# EAGLE design MainClock (EAGLE 8.7.1)

## Sheet 1 of 2
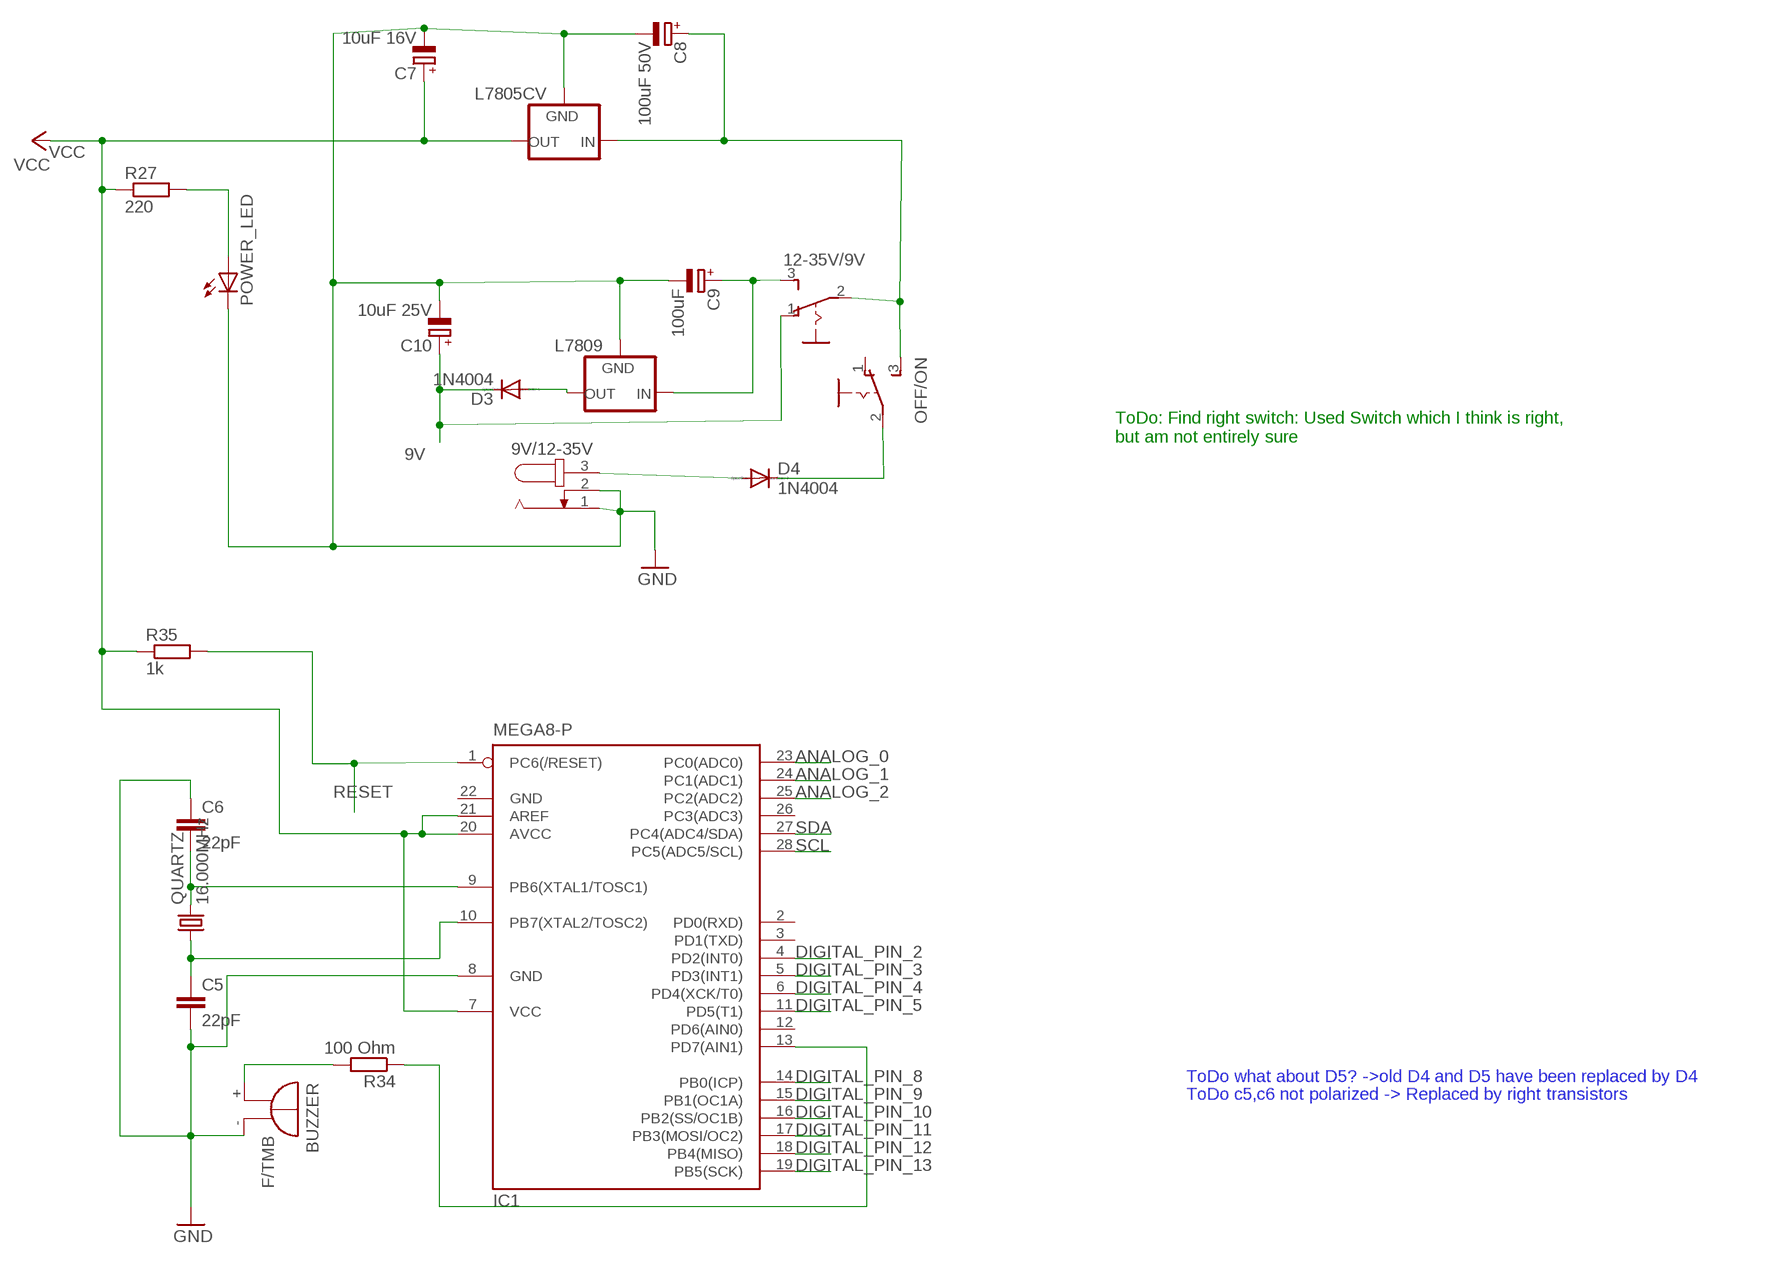
[diagram p0: schematic, sheet 1]

### Parts
9V/12-35V  JACK-PLUG1  [SPC4078]
12-35V/9V  255SB  [255SB]
BUZZER  F/TMB  [F/TMB]
C5  22pF  C-EU025-025X050  [C025-025X050]
C6  22pF  C-EU025-025X050  [C025-025X050]
C7  10uF 16V  CPOL-EUE5-6  [E5-6]
C8  100uF 50V  CPOL-EUE5-8.5  [E5-8,5]
C9  100uF  CPOL-EUE5-8.5  [E5-8,5]
C10  10uF 25V  CPOL-EUE5-6  [E5-6]
D3  1N4004  [DO41-10]
D4  1N4004  [DO41-10]
IC1  MEGA8-P  [DIL28-3]
L7805CV  78XXS  [78XXS]
L7809  78XXS  [78XXS]
OFF/ON  255SB  [255SB]
POWER_LED  LED5MM  [LED5MM]
QUARTZ  16.000MHz  CRYSTALHC49S  [HC49/S]
R27  220  R-EU_0309/10  [0309/10]
R34  100 Ohm  R-EU_0411/15  [0411/15]
R35  1k  R-EU_0309/10  [0309/10]

### Nets
9V: 12-35V/9V.1(O) C10.+ D3.C ; also sheet 2
ANALOG_0: IC1.23(PC0(ADC0)) ; also sheet 2
ANALOG_1: IC1.24(PC1(ADC1)) ; also sheet 2
ANALOG_2: IC1.25(PC2(ADC2)) ; also sheet 2
DIGITAL_PIN_2: IC1.4(PD2(INT0)) ; also sheet 2
DIGITAL_PIN_3: IC1.5(PD3(INT1)) ; also sheet 2
DIGITAL_PIN_4: IC1.6(PD4(XCK/T0)) ; also sheet 2
DIGITAL_PIN_5: IC1.11(PD5(T1)) ; also sheet 2
DIGITAL_PIN_8: IC1.14(PB0(ICP)) ; also sheet 2
DIGITAL_PIN_9: IC1.15(PB1(OC1A)) ; also sheet 2
DIGITAL_PIN_10: IC1.16(PB2(SS/OC1B)) ; also sheet 2
DIGITAL_PIN_11: IC1.17(PB3(MOSI/OC2)) ; also sheet 2
DIGITAL_PIN_12: IC1.18(PB4(MISO)) ; also sheet 2
DIGITAL_PIN_13: IC1.19(PB5(SCK)) ; also sheet 2
GND: 9V/12-35V.1 9V/12-35V.2 BUZZER.- C5.2 C6.1 C7.- C8.- C9.- C10.- IC1.8(GND) L7805CV.GND L7809.GND POWER_LED.K(C) ; also sheet 2
N$1: C6.2 IC1.9(PB6(XTAL1/TOSC1)) QUARTZ.2
N$2: C5.1 IC1.10(PB7(XTAL2/TOSC2)) QUARTZ.1
N$3: BUZZER.+ R34.2
N$4: IC1.13(PD7(AIN1)) R34.1
N$5: 9V/12-35V.3 D4.A
N$6: D4.C OFF/ON.2(P)
N$7: 12-35V/9V.2(P) C8.+ L7805CV.IN OFF/ON.3(S)
N$8: 12-35V/9V.3(S) C9.+ L7809.IN
N$9: POWER_LED.A R27.2
N$10: D3.A L7809.OUT
RESET: IC1.1(PC6(/RESET)) R35.2 ; also sheet 2
SCL: IC1.28(PC5(ADC5/SCL)) ; also sheet 2
SDA: IC1.27(PC4(ADC4/SDA)) ; also sheet 2
VCC: C7.+ IC1.7(VCC) IC1.20(AVCC) IC1.21(AREF) L7805CV.OUT R27.1 R35.1 ; also sheet 2
Unconnected: IC1.2(PD0(RXD)) IC1.3(PD1(TXD)) IC1.12(PD6(AIN0)) IC1.26(PC3(ADC3)) OFF/ON.1(O)

### Notes on the sheet
- ToDo: Find right switch: Used Switch which I think is right,
  but am not entirely sure
- ToDo what about D5? ->old D4 and D5 have been replaced by D4
- ToDo c5,c6 not polarized -> Replaced by right transistors

## Sheet 2 of 2
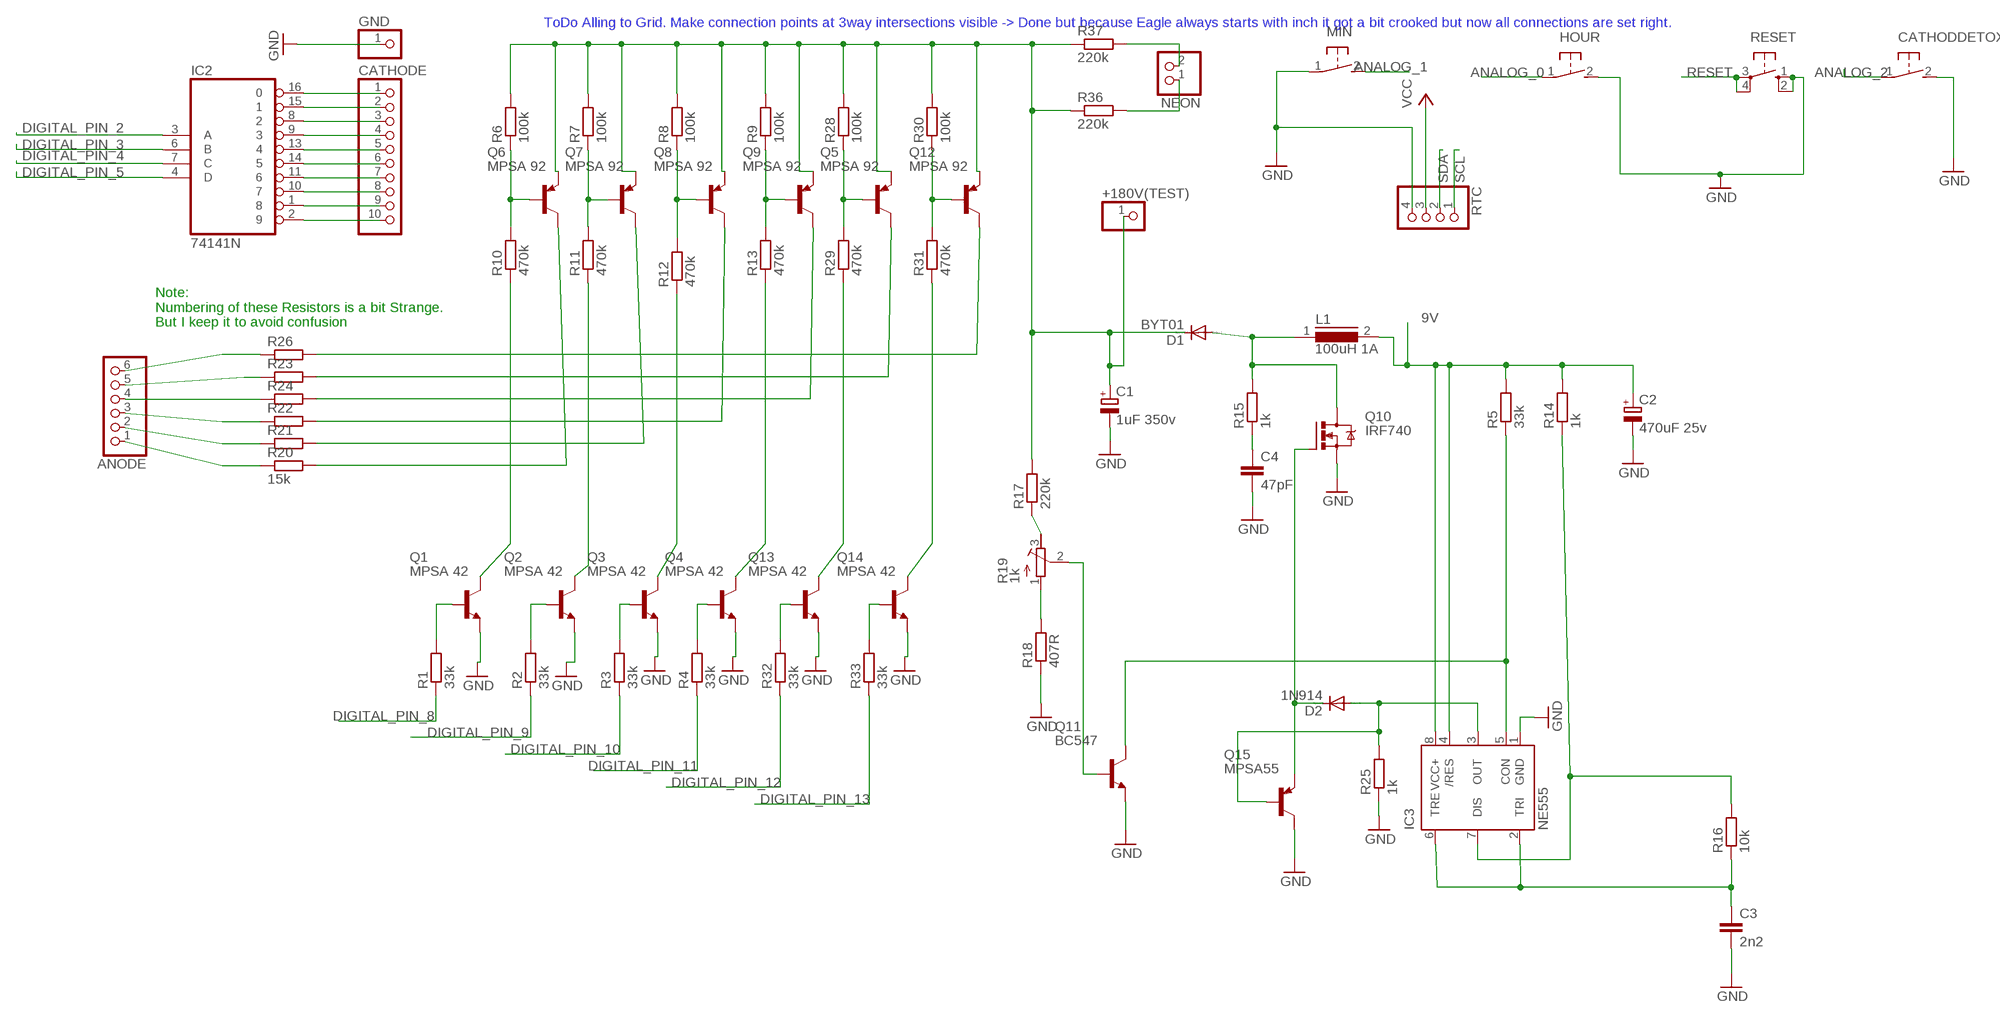
[diagram p1: schematic, sheet 2]

### Parts
+180V(TEST)  PINHD-1X1  [1X01]
ANODE  PINHD-1X6  [1X06]
C1  1uF 350v  CPOL-EUE5-10.5  [E5-10,5]
C2  470uF 25v  CPOL-EUE5-10.5  [E5-10,5]
C3  2n2  C-EU025-024X044  [C025-024X044]
C4  47pF  C-EU025-024X044  [C025-024X044]
CATHODDETOX  31-XX  [B3F-31XX]
CATHODE  PINHD-1X10  [1X10]
D1  BYT01  [F126-10]
D2  1N914  1N4446  [DO35-10]
GND  PINHD-1X1  [1X01]
HOUR  31-XX  [B3F-31XX]
IC2  74141N  [DIL16]
IC3  NE555  [DIL-08]
L1  100uH 1A  MESC26  [MESC26]
MIN  31-XX  [B3F-31XX]
NEON  PINHD-1X2  [1X02]
Q1  MPSA 42  -NPN-TO92  [TO92]
Q2  MPSA 42  -NPN-TO92  [TO92]
Q3  MPSA 42  -NPN-TO92  [TO92]
Q4  MPSA 42  -NPN-TO92  [TO92]
Q5  MPSA 92  MPSA92-PNP-TO92-EBC  [TO92-EBC]
Q6  MPSA 92  MPSA92-PNP-TO92-EBC  [TO92-EBC]
Q7  MPSA 92  MPSA92-PNP-TO92-EBC  [TO92-EBC]
Q8  MPSA 92  MPSA92-PNP-TO92-EBC  [TO92-EBC]
Q9  MPSA 92  MPSA92-PNP-TO92-EBC  [TO92-EBC]
Q10  IRF740  [TO220BV]
Q11  BC547  [TO92]
Q12  MPSA 92  MPSA92-PNP-TO92-EBC  [TO92-EBC]
Q13  MPSA 42  -NPN-TO92  [TO92]
Q14  MPSA 42  -NPN-TO92  [TO92]
Q15  MPSA55  MPSA56-PNP-TO92-BCE  [TO92-BCE]
R1  33k  R-EU_0309/10  [0309/10]
R2  33k  R-EU_0309/10  [0309/10]
R3  33k  R-EU_0309/10  [0309/10]
R4  33k  R-EU_0309/10  [0309/10]
R5  33k  R-EU_0309/10  [0309/10]
R6  100k  R-EU_0309/10  [0309/10]
R7  100k  R-EU_0309/10  [0309/10]
R8  100k  R-EU_0309/10  [0309/10]
R9  100k  R-EU_0309/10  [0309/10]
R10  470k  R-EU_0309/10  [0309/10]
R11  470k  R-EU_0309/10  [0309/10]
R12  470k  R-EU_0309/10  [0309/10]
R13  470k  R-EU_0309/10  [0309/10]
R14  1k  R-EU_0309/10  [0309/10]
R15  1k  R-EU_0309/10  [0309/10]
R16  10k  R-EU_0309/10  [0309/10]
R17  220k  R-EU_0309/10  [0309/10]
R18  407R  R-EU_0309/10  [0309/10]
R19  1k  R-TRIMM3339P  [RTRIM3339P]
R20  15k  R-EU_0309/10  [0309/10]
R21  15k  R-EU_0309/10  [0309/10]
R22  15k  R-EU_0309/10  [0309/10]
R23  15k  R-EU_0309/10  [0309/10]
R24  15k  R-EU_0309/10  [0309/10]
R25  1k  R-EU_0309/10  [0309/10]
R26  15k  R-EU_0309/10  [0309/10]
R28  100k  R-EU_0309/10  [0309/10]
R29  470k  R-EU_0309/10  [0309/10]
R30  100k  R-EU_0309/10  [0309/10]
R31  470k  R-EU_0309/10  [0309/10]
R32  33k  R-EU_0309/10  [0309/10]
R33  33k  R-EU_0309/10  [0309/10]
R36  220k  R-EU_0309/10  [0309/10]
R37  220k  R-EU_0309/10  [0309/10]
RESET  10-XX  [B3F-10XX]
RTC  PINHD-1X4  [1X04]

### Nets
9V: C2.+ IC3.4(/RES) IC3.8(VCC+) L1.2 R5.2 R14.2 ; also sheet 1
ANALOG_0: HOUR.1(P) ; also sheet 1
ANALOG_1: MIN.2(S) ; also sheet 1
ANALOG_2: CATHODDETOX.1(P) ; also sheet 1
DIGITAL_PIN_2: IC2.3(A) ; also sheet 1
DIGITAL_PIN_3: IC2.6(B) ; also sheet 1
DIGITAL_PIN_4: IC2.7(C) ; also sheet 1
DIGITAL_PIN_5: IC2.4(D) ; also sheet 1
DIGITAL_PIN_8: R1.1 ; also sheet 1
DIGITAL_PIN_9: R2.1 ; also sheet 1
DIGITAL_PIN_10: R3.1 ; also sheet 1
DIGITAL_PIN_11: R4.1 ; also sheet 1
DIGITAL_PIN_12: R32.1 ; also sheet 1
DIGITAL_PIN_13: R33.1 ; also sheet 1
GND: C1.- C2.- C3.2 C4.2 CATHODDETOX.2(S) GND.1 HOUR.2(S) IC3.1(GND) MIN.1(P) Q1.1(E) Q2.1(E) Q3.1(E) Q4.1(E) Q10.S Q11.1(E) Q13.1(E) Q14.1(E) Q15.C R18.1 R25.1 RESET.1(S) RESET.2(S1) RTC.4 ; also sheet 1
N$11: ANODE.6 R26.1
N$12: ANODE.5 R23.1
N$13: ANODE.4 R24.1
N$14: ANODE.3 R22.1
N$15: ANODE.2 R21.1
N$16: ANODE.1 R20.1
N$17: Q1.2(B) R1.2
N$18: Q2.2(B) R2.2
N$19: Q13.2(B) R32.2
N$20: Q14.2(B) R33.2
N$21: Q4.2(B) R4.2
N$22: Q3.2(B) R3.2
N$23: Q1.3(C) R10.1
N$24: Q2.3(C) R11.1
N$25: Q3.3(C) R12.1
N$26: Q4.3(C) R13.1
N$27: Q13.3(C) R29.1
N$28: Q14.3(C) R31.1
N$29: Q12.B R30.1 R31.2
N$30: Q5.B R28.1 R29.2
N$31: Q9.B R9.1 R13.2
N$32: Q8.B R8.1 R12.2
N$33: Q7.B R7.1 R11.2
N$34: +180V(TEST).1 C1.+ D1.C Q5.E Q6.E Q7.E Q8.E Q9.E Q12.E R6.2 R7.2 R8.2 R9.2 R17.2 R28.2 R30.2 R36.1 R37.1
N$35: Q12.C R26.2
N$36: Q5.C R23.2
N$37: Q9.C R24.2
N$38: Q8.C R22.2
N$39: Q7.C R21.2
N$40: Q6.C R20.2
N$42: CATHODE.1 IC2.16
N$43: CATHODE.2 IC2.15
N$44: CATHODE.6 IC2.14
N$45: CATHODE.5 IC2.13
N$46: CATHODE.7 IC2.11
N$47: CATHODE.8 IC2.10
N$48: CATHODE.4 IC2.9
N$49: CATHODE.3 IC2.8
N$50: CATHODE.9 IC2.1
N$51: CATHODE.10 IC2.2
N$52: NEON.1 R36.2
N$53: NEON.2 R37.2
N$54: C3.1 IC3.2(TRI) IC3.6(TRE) R16.1
N$55: Q6.B R6.1 R10.2
N$56: D1.A L1.1 Q10.D R15.2
N$57: C4.1 R15.1
N$58: IC3.7(DIS) R14.1 R16.2
N$59: IC3.5(CON) Q11.3(C) R5.1
N$60: R18.2 R19.1(A)
N$61: R17.1 R19.3(E)
N$62: D2.A IC3.3(OUT) Q15.B R25.2
N$63: D2.C Q10.G Q15.E
N$64: Q11.2(B) R19.2(S)
RESET: RESET.3(P) RESET.4(P1) ; also sheet 1
SCL: RTC.1 ; also sheet 1
SDA: RTC.2 ; also sheet 1
VCC: RTC.3 ; also sheet 1

### Notes on the sheet
- ToDo Alling to Grid. Make connection points at 3way intersections visible -> Done but because Eagle always starts with inch it got a bit crooked but now all connections are set right.
- Note:
  Numbering of these Resistors is a bit Strange.
  But I keep it to avoid confusion

## Power pins joined to a net without a drawn wire
GND: IC1.22(GND) IC2.12(GND)
VCC: IC2.5(VCC)

## Library data of the parts
9V/12-35V = con-jack:JACK-PLUG: DC POWER JACK Power Jack, DC, Right Angle, Through Hole, Rated 5A at 16VDC, PC Terminals Distributor: Farnell (www.Farnell.de) Drawing: 84N1161.pdf / 84N1162.pdf Manufacturer: SPC Technology (www.spctechnology.com) Type: SPC4077 / SPC 4078; OC_FARNELL: unknown; OC_NEWARK: unknown
12-35V/9V OFF/ON = switch:255SB: SLIDING SWITCH Distributor Buerklin, 11G810
+180V(TEST) GND = pinhead:PINHD-1X1: PIN HEADER
ANODE = pinhead:PINHD-1X6: PIN HEADER
BUZZER = buzzer:F/TMB: BUZZER Source: Buerklin; OC_FARNELL: unknown; OC_NEWARK: unknown
C1 C2 C7-C10 = resistor:CPOL-EU: POLARIZED CAPACITOR, European symbol
C3-C6 = resistor:C-EU: CAPACITOR, European symbol
CATHODDETOX HOUR MIN = switch-omron:31-XX: OMRON SWITCH; MPN: B3F-3100; OC_FARNELL: 959704; OC_NEWARK: 36M3582
CATHODE = pinhead:PINHD-1X10: PIN HEADER
D1 = diode:BYT01: DIODE ultra fast
D2 = diode:1N4446: DIODE high speed (Philips)
D3 D4 = diode:1N4004: DIODE general purpose rectifier, 1 A
IC1 = atmel:MEGA8-P: MICROCONTROLLER 8 Kbytes FLASH, 1 kbytes SRAM, 512 bytes EEPROM, USART, 4-channel 10 bit ADC, 2-channel 8 bit ADC Pin compatible with Atmega48, ATMega88, ATMega168 Source: avr.lbr; OC_FARNELL: unknown; OC_NEWARK: unknown
IC2 = 74xx-us:74*141: BCD to decimal DECODER/DRIVER
IC3 = st-microelectronics:NE555: General purpose bipolar Timer; MF: Arrow Electronics; MPN: NE555N; OC_FARNELL: 1467742; OC_NEWARK: 89K1486
L1 = inductors:MESC26: INDUCTOR; SPICEPREFIX: L
L7805CV L7809 = v-reg:78XXS: VOLTAGE REGULATOR
NEON = pinhead:PINHD-1X2: PIN HEADER
POWER_LED = led:LED: LED OSRAM: - CHIPLED LG R971, LG N971, LY N971, LG Q971, LY Q971, LO R971, LY R971 LH N974, LH R974 LS Q976, LO Q976, LY Q976 LO Q996 - Hyper CHIPLED LW Q18S LB Q993, LB Q99A, LB R99A - SideLED LS A670, LO A670, LY A670, LG A670, LP A670 LB A673, LV A673, LT A673, LW A673 LH A674 LY A675 LS A676, LA A676, LO A676, LY A676, LW A676 LS A679, LY A679, LG A679 - Hyper Micro SIDELED® LS Y876, LA Y876, LO Y876, LY Y876 LT Y87S - SmartLED LW L88C, LW L88S LB L89C, LB L89S, LG L890 LS L89K, LO L89K, LY L89K LS L896, LA L896, LO L896, LY L896 - TOPLED LS T670, LO T670, LY T670, LG T670, LP T670 LSG T670, LSP T670, LSY T670, LOP T670, LYG T670 LG T671, LOG T671, LSG T671 LB T673, LV T673, LT T673, LW T673 LH T674 LS T676, LA T676, LO T676, LY T676, LB T676, LH T676, LSB T676, LW T676 LB T67C, LV T67C, LT T67C, LS T67K, LO T67K, LY T67K, LW E67C LS E67B, LA E67B, LO E67B, LY E67B, LB E67C, LV E67C, LT E67C LW T67C LS T679, LY T679, LG T679 LS T770, LO T770, LY T770, LG T770, LP T770 LB T773, LV T773, LT T773, LW T773 LH T774 LS E675, LA E675, LY E675, LS T675 LS T776, LA T776, LO T776, LY T776, LB T776 LHGB T686 LT T68C, LB T68C - Hyper Mini TOPLED® LB M676 - Mini TOPLED Santana® LG M470 LS M47K, LO M47K, LY M47K Source: http://www.osram.convergy.de LUXEON: - LUMILED® LXK2-PW12-R00, LXK2-PW12-S00, LXK2-PW14-U00, LXK2-PW14-V00 LXK2-PM12-R00, LXK2-PM12-S00, LXK2-PM14-U00 LXK2-PE12-Q00, LXK2-PE12-R00, LXK2-PE12-S00, LXK2-PE14-T00, LXK2-PE14-U00 LXK2-PB12-K00, LXK2-PB12-L00, LXK2-PB12-M00, LXK2-PB14-N00, LXK2-PB14-P00, LXK2-PB14-Q00 LXK2-PR12-L00, LXK2-PR12-M00, LXK2-PR14-Q00, LXK2-PR14-R00 LXK2-PD12-Q00, LXK2-PD12-R00, LXK2-PD12-S00 LXK2-PH12-R00, LXK2-PH12-S00 LXK2-PL12-P00, LXK2-PL12-Q00, LXK2-PL12-R00 Source: www.luxeon.com KINGBRIGHT: KA-3528ASYC Source: www.kingbright.com
Q1-Q4 Q13 Q14 = transistor:*-NPN-: NPN Transistror BF959 corrected 2008.03.06
Q5-Q9 Q12 Q15 = transistor:*-PNP-: PNP Transistror
Q10 = transistor-power:IRF740: N-CHANNEL MOS FET
Q11 = transistor:BC547: NPN TRANSISTOR
QUARTZ = crystal:CRYSTAL: CRYSTAL; OC_FARNELL: 1667008; OC_NEWARK: unknown
R1-R18 R20-R37 = resistor:R-EU_: RESISTOR, European symbol
R19 = resistor:R-TRIMM: Trimm resistor
RESET = switch-omron:10-XX: OMRON SWITCH; MPN: B3F-1000; OC_FARNELL: 176432; OC_NEWARK: 36M3542
RTC = pinhead:PINHD-1X4: PIN HEADER

## Board
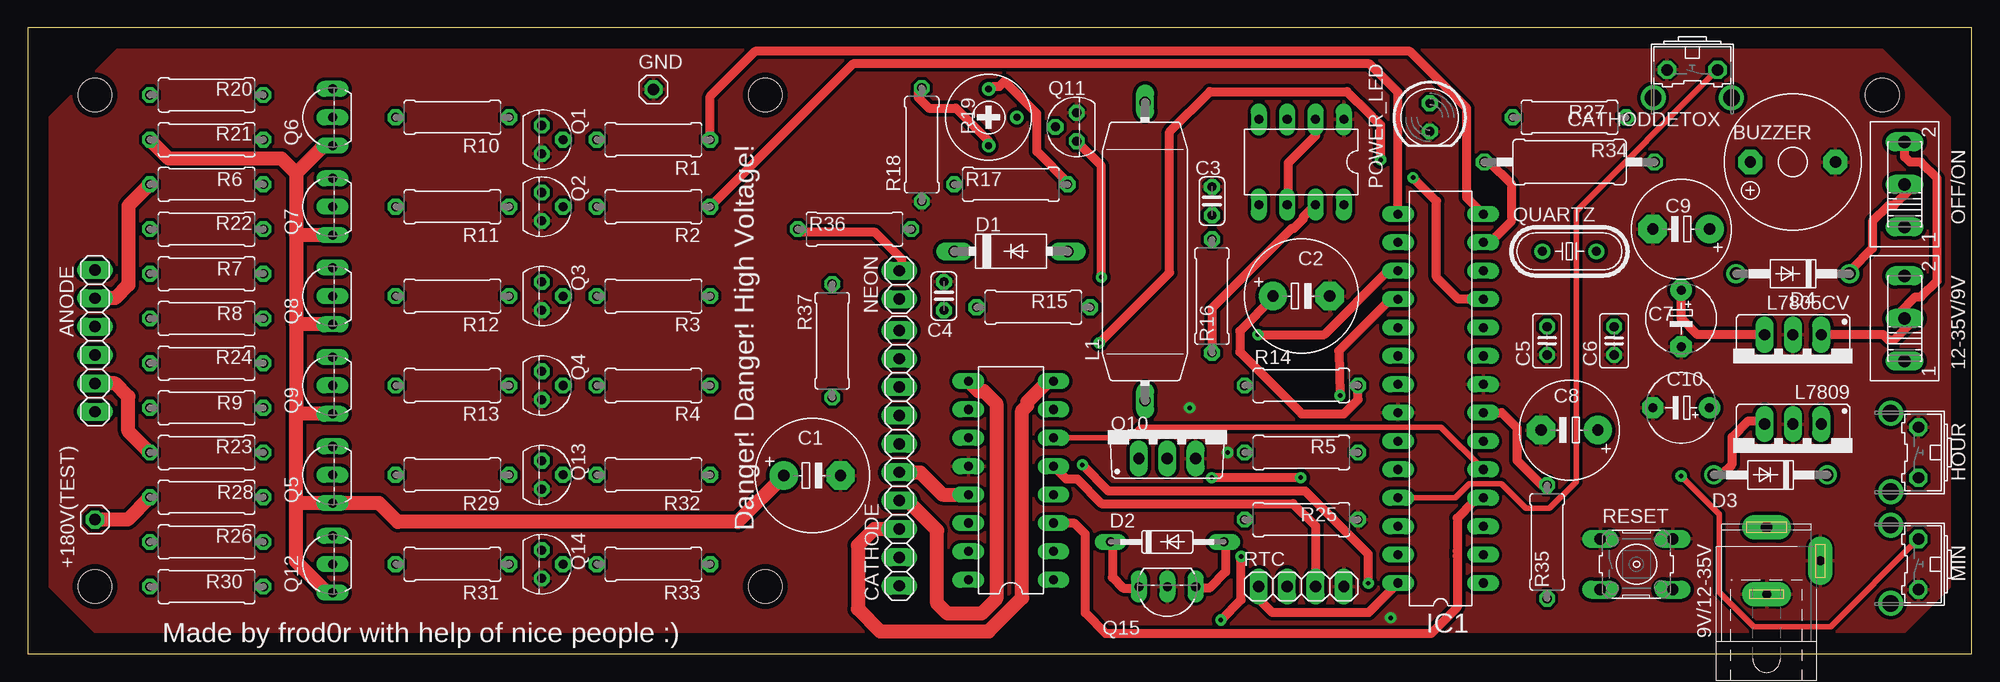
[diagram p2: board, top side]
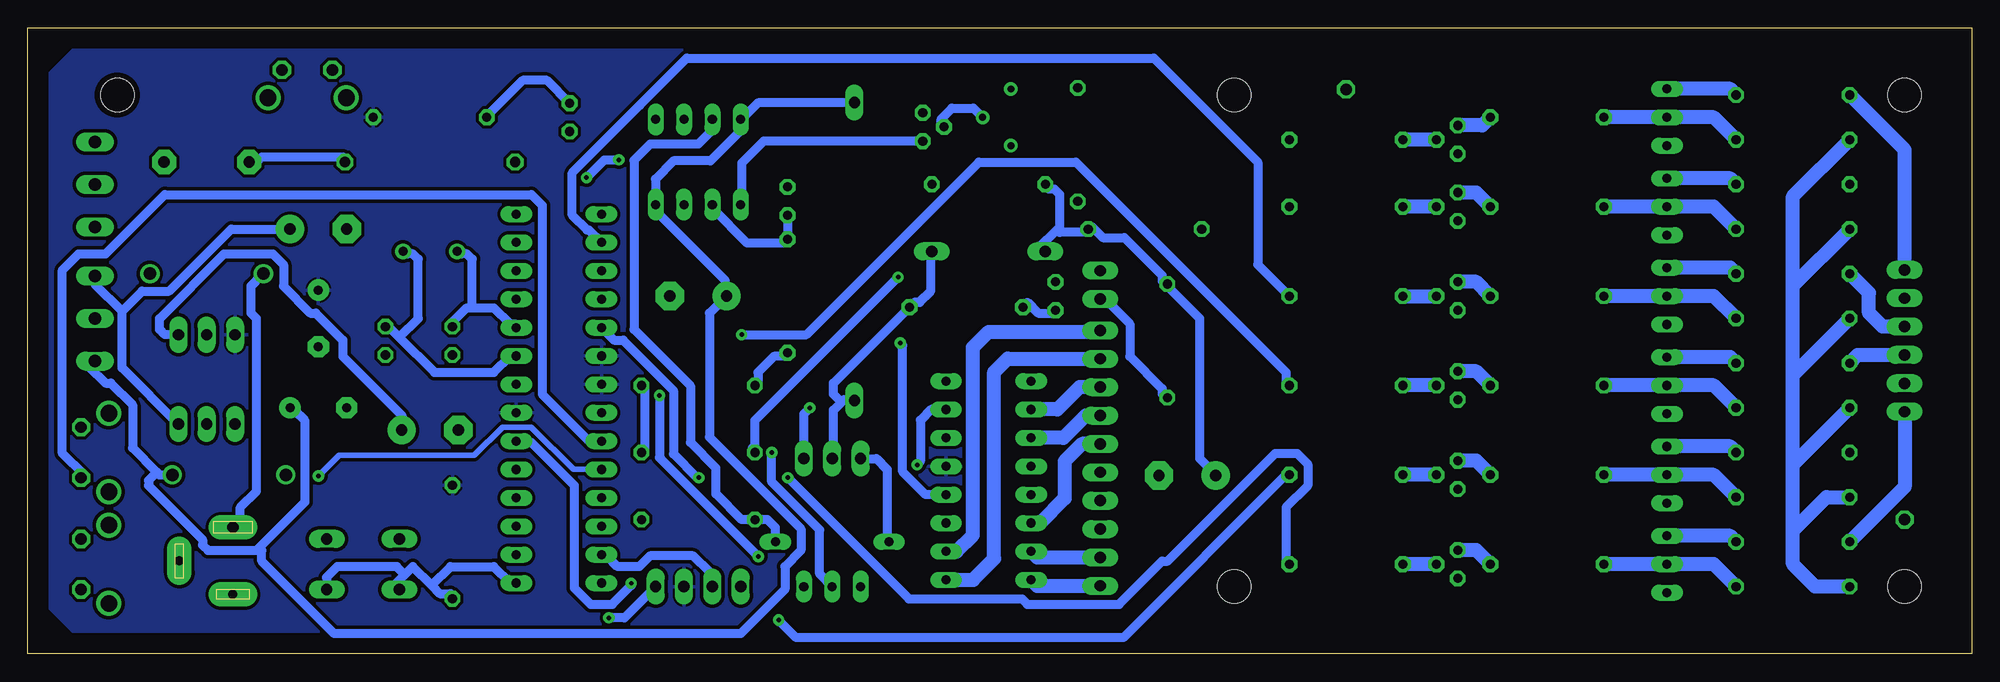
[diagram p3: board, bottom side, seen from below]

Size 174 x 56 mm. Coordinates in mm from the lower left corner, seen from the top.
Outline: 0,0 174,0 174,56 0,56 0,0
Copper layers (1*16): Top 0.035mm / dielectric 1.5mm / Bottom 0.035mm
Design rules "FVM_default": minimum track width 0.3mm, minimum drill 0.4mm, track to track 0.3mm, track to pad 0.3mm, pad to pad 0.3mm, via to via 0.3mm, smd to smd 0.15mm, copper to edge 0.5mm, drill to drill 0.2mm, minimum pad ring 0.3mm, minimum via ring 0.3mm, stop-mask expansion 0.075mm, vias tented up to drill 0mil, thermal gap 0.2mm
Holes 3 mm at 166,50 6,50 66,50 66,6 6,6

### Footprints (pad centres in the part's own frame; a part is rotated, then mirrored left to right if it is on the bottom)
SPC4078 = drill 0.8 pad 2.184 long: 1 -3,0; 2 0,-4.8 | drill 1 pad 2.184 long: 3 3,0
255SB = drill 1.118 long: 1 -3.81,0; 2 0,0; 3 3.81,0
1X01 = drill 1.016 octagon: 1 0,0
1X06 = drill 1.016 long: 1 -6.35,0; 2 -3.81,0; 3 -1.27,0; 4 1.27,0; 5 3.81,0; 6 6.35,0
F/TMB = drill 1.016 pad 2.159 octagon: + 3.81,0; - -3.81,0
E5-10,5 = drill 1.016 pad 2.54: + -2.54,0 | drill 1.016 pad 2.54 octagon: - 2.54,0
C025-024X044 = drill 0.813 octagon: 1 -1.27,0; 2 1.27,0
C025-025X050 = drill 0.813 octagon: 1 -1.27,0; 2 1.27,0
E5-6 = drill 0.813 pad 1.905: + -2.54,0 | drill 0.813 pad 1.905 octagon: - 2.54,0
E5-8,5 = drill 1.016 pad 2.54: + -2.54,0 | drill 1.016 pad 2.54 octagon: - 2.54,0
B3F-31XX = drill 1.016 octagon: 1 -2.261,-1.245; 2 2.261,-1.245 | drill 1.499 pad 2.159: 3 -3.505,1.245; 4 3.505,1.245
1X10 = drill 1.016 long: 1 -11.43,0; 2 -8.89,0; 3 -6.35,0; 4 -3.81,0; 5 -1.27,0; 6 1.27,0; 7 3.81,0; 8 6.35,0; 9 8.89,0; 10 11.43,0
F126-10 = drill 1.016 long: A 5.08,0; C -5.08,0
DO35-10 = drill 0.813 long: A 5.08,0; C -5.08,0
DO41-10 = drill 1.118: A 5.08,0; C -5.08,0
DIL28-3 = drill 0.813 long: 1 -16.51,-3.81; 2 -13.97,-3.81; 3 -11.43,-3.81; 4 -8.89,-3.81; 5 -6.35,-3.81; 6 -3.81,-3.81; 7 -1.27,-3.81; 8 1.27,-3.81; 9 3.81,-3.81; 10 6.35,-3.81; 11 8.89,-3.81; 12 11.43,-3.81; 13 13.97,-3.81; 14 16.51,-3.81; 15 16.51,3.81; 16 13.97,3.81; 17 11.43,3.81; 18 8.89,3.81; 19 6.35,3.81; 20 3.81,3.81; 21 1.27,3.81; 22 -1.27,3.81; 23 -3.81,3.81; 24 -6.35,3.81; 25 -8.89,3.81; 26 -11.43,3.81; 27 -13.97,3.81; 28 -16.51,3.81
DIL16 = drill 0.813 long: 1 -8.89,-3.81; 2 -6.35,-3.81; 3 -3.81,-3.81; 4 -1.27,-3.81; 5 1.27,-3.81; 6 3.81,-3.81; 7 6.35,-3.81; 8 8.89,-3.81; 9 8.89,3.81; 10 6.35,3.81; 11 3.81,3.81; 12 1.27,3.81; 13 -1.27,3.81; 14 -3.81,3.81; 15 -6.35,3.81; 16 -8.89,3.81
DIL-08 = drill 0.813 long: 1 -3.81,-3.81; 2 -1.27,-3.81; 3 1.27,-3.81; 4 3.81,-3.81; 5 3.81,3.81; 6 1.27,3.81; 7 -1.27,3.81; 8 -3.81,3.81
MESC26 = drill 1.016 long: 1 -13.335,0; 2 13.335,0
78XXS = drill 1.016 long: GND 0,-2.54; IN -2.54,-2.54; OUT 2.54,-2.54
1X02 = drill 1.016 long: 1 -1.27,0; 2 1.27,0
LED5MM = drill 0.813 octagon: A -1.27,0; K 1.27,0
TO92 = drill 0.813 octagon: 1 1.27,0; 2 0,1.905; 3 -1.27,0
TO92-EBC = drill 0.813 long: B 0,-1.27; C 2.54,-1.27; E -2.54,-1.27
TO220BV = drill 1.016 long: D 0,-2.54; G -2.54,-2.54; S 2.54,-2.54
TO92-BCE = drill 0.813 long: B -2.54,0; C 0,0; E 2.54,0
HC49/S = drill 0.813: 1 -2.413,0; 2 2.413,0
0309/10 = drill 0.813 octagon: 1 -5.08,0; 2 5.08,0
RTRIM3339P = drill 0.61: 1 -2.54,0; 2 0,-2.54; 3 2.54,0
0411/15 = drill 0.914 octagon: 1 -7.62,0; 2 7.62,0
B3F-10XX = drill 1.016 long: 1 -3.251,2.261; 2 3.251,2.261; 3 -3.251,-2.261; 4 3.251,-2.261
1X04 = drill 1.016 long: 1 -3.81,0; 2 -1.27,0; 3 1.27,0; 4 3.81,0

### Placement (x,y rotation side)
9V/12-35V  155.65,8.31 90 top
12-35V/9V  168,30 90 top
+180V(TEST)  6,12 0 top
ANODE  6,28 270 top
BUZZER  158,44 180 top
C1  70.21,15.94 0 top
C2  114,32 0 top
C3  106,40.5 90 top
C4  82,32 90 top
C5  136,28 270 top
C6  142,28 90 top
C7  148,30 270 top
C8  138,20 180 top
C9  148,38 180 top
C10  148,22 180 top
CATHODDETOX  149,51 180 top
CATHODE  78,17.5 90 top
D1  88,36 0 top
D2  102,10 0 top
D3  156,16 180 top
D4  158,34 180 top
GND  56,50.5 0 top
HOUR  168,18 90 top
IC1  126.47,22.83 90 top
IC2  88,15.5 90 top
IC3  114,44 180 top
L1  100,36 90 top
L7805CV  158,26 180 top
L7809  158,18 180 top
MIN  168,8 90 top
NEON  78,33 270 top
OFF/ON  168,42 90 top
POWER_LED  125.5,48 270 top
Q1  46,46 270 top
Q2  46,40 270 top
Q3  46,32 270 top
Q4  46,24 270 top
Q5  26,16 90 top
Q6  26,48 90 top
Q7  26,40 90 top
Q8  26,32 90 top
Q9  26,24 90 top
Q10  102,20 0 top
Q11  93.89,47.14 90 top
Q12  26,8 90 top
Q13  46,16 270 top
Q14  46,8 270 top
Q15  102,6 180 top
QUARTZ  138,36 0 top
R1  56,46 180 top
R2  56,40 180 top
R3  56,32 180 top
R4  56,24 180 top
R5  114,18 0 top
R6  16,46 180 top
R7  16,38 180 top
R8  16,30 180 top
R9  16,22 180 top
R10  38,48 180 top
R11  38,40 180 top
R12  38,32 180 top
R13  38,24 180 top
R14  114,24 0 top
R15  90,31 0 top
R16  106,32 270 top
R17  88,42 180 top
R18  80.02,45.55 90 top
R19  86,48 90 top
R20  16,50 0 top
R21  16,42 0 top
R22  16,34 0 top
R23  16,18 0 top
R24  16,26 0 top
R25  114,12 180 top
R26  16,10 0 top
R27  138,48 180 top
R28  16,14 180 top
R29  38,16 180 top
R30  16,6 180 top
R31  38,8 180 top
R32  56,16 180 top
R33  56,8 180 top
R34  138,44 0 top
R35  136,10 270 top
R36  74,38 180 top
R37  72,28 270 top
RESET  144,8 0 top
RTC  114,6 0 top

### Tracks (layer width: path | path; a pad name or v marks a point on that pad's centre or on a via)
9V
  Top 0.813: C2.+ 111.55,31.92 108.5,28.87 108.5,27 114.05,21.45 117.8,21.45 119.08,22.73 R14.2
  Bottom 0.813: 162.46,16.24 164.64,18.41 164.64,22.27 166.57,24.2 167.05,24.2 168.5,25.65 168.5,26.13 168.01,26.61 12-35V/9V.1 | 162.46,16.24 162.22,15.99 161.26,15.99 D3.C | 153.29,9.48 153.54,9.24 157.88,9.24 158.36,9.72 158.36,10.2 163.19,15.03 163.19,15.51 162.46,16.24 | 153.29,9.48 149.19,13.58 149.19,20.82 150.16,21.79 C10.+ | L1.2 100.45,49.3 108.66,49.3 110.1,47.85 IC3.4 110.19,46.81 112.9,44.1 116.2,44.1 117.82,42.48 117.82,41.09 117.82,40.61 IC3.8 117.82,40.12 117.82,39.64 111.55,33.37 111.55,32.4 C2.+ 111.55,31.92 113,30.47 113,19.37 104.79,11.17 104.79,9.24 106.24,7.79 106.24,5.76 110.2,1.8 146.58,1.8 153.05,8.27 153.05,9.24 153.29,9.48 | R5.2 118.79,18.41 118.79,23.72 R14.2
ANALOG_0
  Bottom 0.813: IC1.23 123.13,18.89 123.61,18.89 127.96,23.23 127.96,40.12 128.92,41.09 161.74,41.09 167.05,35.78 169.46,35.78 170.91,34.33 170.91,17.93 168.98,15.99 HOUR.1
ANALOG_1  (via drill 0.4)
  Top 0.508: MIN.2 161.38,2.4 154.5,2.4 151.4,5.5 151.4,12.49 v147.99,15.9
  Bottom 0.508: IC1.24 125.16,16.48 128.96,20.28 131.51,20.28 134.05,17.74 146.15,17.74 v147.99,15.9
ANALOG_2
  Top 0.508: CATHODDETOX.1 138.6,39.58 138.6,15.4 136.2,13 134.1,13 131.9,15.2 129.05,15.2 127.79,13.94 IC1.25
DIGITAL_PIN_2
  Top 0.813: IC2.3 92.25,11.65 93.69,11.65 94.66,10.69 94.66,3.64 96.5,1.8 102.6,1.8 125.6,1.8 127.96,4.16 127.96,8.76 127.96,9.2 127.96,12.13 129.41,13.58 129.41,14.06 129.89,14.06 IC1.4
DIGITAL_PIN_3
  Top 0.508: IC2.6 98.58,19.31 99.55,20.28 126.48,20.28 IC1.5
DIGITAL_PIN_4  (via drill 0.4)
  Top 0.813: v120,6.3 120,8.9 114.35,14.55 96.75,14.55 v94.4,16.9
  Bottom 0.813: IC1.6 129.89,18.89 128.92,18.89 125.06,15.03 125.06,5.86 123.61,4.41 121.69,4.41 120,6.1 v120,6.3 | IC2.7 93.15,21.85 94.1,20.9 94.1,17.2 v94.4,16.9
DIGITAL_PIN_5  (via drill 0.4)
  Top 0.813: v95.9,27.8 102.2,34.1 102.2,46.7 105.8,50.3 118.1,50.3 120.05,48.35 120.6,47.8 121.1,47.3 v121.1,44.2 | IC1.11 128.08,31.72 126.1,33.7 126.1,40.49 v124,42.6
  Bottom 0.813: IC2.4 93.63,14.23 95.7,16.3 95.7,27.6 v95.9,27.8 | v124,42.6 122.39,44.2 v121.1,44.2
DIGITAL_PIN_8
  Top 0.813: IC1.14 128.8,40.82 128.8,48.8 123.7,53.9 65.1,53.9 61.08,49.88 R1.1
DIGITAL_PIN_9
  Top 0.813: R2.1 73.87,52.79 120.11,52.79 122.66,50.24 IC1.15
DIGITAL_PIN_10
  Bottom 0.813: IC1.16 123.79,37.93 123.95,37.93 125.28,39.26 125.28,43.02 119.22,49.08 119.22,49.1 115.02,53.3 73.2,53.3 63.9,44 63.9,34.82 R3.1
DIGITAL_PIN_11  (via drill 0.4)
  Top 0.813: v110.1,28.54 116.04,28.54 121.76,34.26 IC1.17
  Bottom 0.813: v110.1,28.54 104.31,28.54 88.87,43.99 80.18,43.99 61.36,25.16 61.36,24.2 R4.1
DIGITAL_PIN_12  (via drill 0.4)
  Top 0.813: v106.8,3.01 108.61,4.82 v108.61,8.69 | IC1.18 121.97,31.72 117.34,27.09 117.44,23.12 v117.46,23.1
  Bottom 0.813: R32.1 61.36,15.99 75.93,1.42 105.22,1.42 v106.8,3.01 | v108.61,8.69 117.34,17.43 | 117.34,17.43 117.34,17.44 | v117.46,23.1 117.46,17.54 117.34,17.43
DIGITAL_PIN_13  (via drill 0.4)
  Top 0.813: v113.95,15.75 v105.97,15.75
  Bottom 0.813: 95.14,4.9 95.11,4.9 | R33.1 61.36,8.27 61.36,13.1 59.43,15.03 59.43,16.96 60.4,17.93 62.33,17.93 71.98,8.27 72.46,8.27 76.32,4.41 84.53,4.41 85.01,4.9 93.7,4.9 95.11,4.9 | IC1.19 121.53,28.05 120.71,28.05 116.2,23.55 116.2,17.88 114.08,15.75 v113.95,15.75 | v105.97,15.75 95.11,4.9
GND  (via drill 0.4)
  Bottom 0.813: Q10.S 104.54,21.46 v104,22 | Q15.C 103.13,7.13 103.13,11.08 107.41,15.36 v107.41,18 | RTC.4 120.6,3.21 v122,3.21
  pour Top: 2,38 2,48 8,54 166,54 172,48 172,6 168,2 6,2 2,6
N$1
  Bottom 0.813: 140.75,28.3 141.95,29.51 C6.2 | 140.75,28.3 137.61,25.16 132.3,25.16 130.85,26.61 130.37,26.61 IC1.9 | 140.75,28.3 139.06,29.99 139.06,35.3 139.54,35.78 140.02,35.78 QUARTZ.2
N$2
  Bottom 0.813: 134.23,30.96 134.72,30.96 136.16,29.51 C5.1 | 134.23,30.96 132.3,30.96 130.85,29.51 130.37,29.51 IC1.10 | 134.23,30.96 134.23,35.3 134.72,35.78 135.2,35.78 QUARTZ.1
N$3
  Bottom 0.813: R34.2 145.81,44.47 153.05,44.47 153.54,43.99 154.02,43.99 BUZZER.+
N$4
  Top 0.813: IC1.13 130.37,36.75 130.85,36.75 132.78,38.68 132.78,42.06 130.85,43.99 R34.1
N$5
  Bottom 0.813: D4.A 153.05,33.85 154.02,32.89 154.02,30.47 153.54,29.99 153.54,14.55 154.98,13.1 154.98,11.65 155.47,11.17 9V/12-35V.3
N$6
  Top 0.813: D4.C 163.19,34.33 165.12,36.27 165.12,38.68 166.57,40.12 167.05,40.12 168.5,41.57 168.01,42.06 OFF/ON.2
N$7
  Top 0.813: L7805CV.IN 160.78,28.54 166.08,28.54 166.57,28.06 167.05,28.06 168.5,29.51 168.5,29.99 168.01,30.47 12-35V/9V.2 167.53,30.47 168.98,31.92 169.46,31.92 170.91,33.37 170.91,42.54 169.46,43.99 168.5,43.99 168.01,44.47 168.01,45.43 OFF/ON.3
  Bottom 0.813: C8.+ 140.51,20.34 140.51,21.3 145.81,26.61 145.81,28.06 148.23,30.47 148.71,30.47 151.12,32.89 151.12,34.82 152.09,35.78 156.43,35.78 162.22,29.99 162.22,29.03 161.74,28.54 160.78,28.54 L7805CV.IN
N$8
  Bottom 0.813: L7809.IN 165.58,25.58 165.58,30.65 | 12-35V/9V.3 168,33.07 165.58,30.65 | 165.58,30.65 163.79,32.44 161.37,32.44 155.8,38 C9.+
N$9
  Bottom 0.813: POWER_LED.A 127.53,51.3 129.7,51.3 132.92,48.08 R27.2
N$10
  Top 0.813: L7809.OUT 154.98,20.82 154.02,20.82 152.57,19.37 152.57,16.96 151.61,15.99 151.12,15.99 D3.A
N$11
  Bottom 1.27: ANODE.6 6,14.92 R26.1
N$12
  Top 1.27: R23.1 9,19.92 9,23 7.81,24.19 ANODE.5
N$13
  Bottom 1.27: R24.1 10.19,26.73 ANODE.4
N$14
  Bottom 1.27: ANODE.3 7.97,29.27 9.2,30.5 9.2,32.28 R22.1
N$15
  Top 1.27: R21.1 9,40.08 9,33 7.81,31.81 ANODE.2
N$16
  Bottom 1.27: ANODE.1 6,45.08 R20.1
N$17
  Bottom 1.27: Q1.2 R1.2
N$18
  Bottom 1.27: Q2.2 R2.2
N$19
  Bottom 1.27: Q13.2 R32.2
N$20
  Bottom 1.27: Q14.2 R33.2
N$21
  Bottom 1.27: Q4.2 R4.2
N$22
  Bottom 0.813: Q3.2 47.85,31.92 48,32
  Bottom 1.27: R3.2 48,32
N$23
  Bottom 1.27: R10.1 43.81,47.27 Q1.3
N$24
  Bottom 1.27: R11.1 44.35,41.27 Q2.3
N$25
  Bottom 1.27: R12.1 44.35,33.27 Q3.3
N$26
  Bottom 1.27: R13.1 44.35,25.27 Q4.3
N$27
  Bottom 1.27: R29.1 44.35,17.27 Q13.3
N$28
  Bottom 1.27: R31.1 44.35,9.27 Q14.3
N$29
  Bottom 1.27: R31.2 Q12.B 23.08,8 R30.1
N$30
  Bottom 1.27: R29.2 Q5.B 23.08,16 R28.1
N$31
  Bottom 1.27: R13.2 Q9.B 23.08,24 R9.1
N$32
  Bottom 1.27: R12.2 Q8.B 23.08,32 R8.1
N$33
  Bottom 1.27: R11.2 Q7.B 23.08,40 R7.1
N$34
  Top 1.27: Q6.E 26.46,45.46 24,43 | 24,43 24,37.5 | 24,37.5 24,29.5 | 24,29.5 24,21.5 | R28.2 8.92,12 +180V(TEST).1 | Q8.E 24.04,29.46 24,29.5 | Q7.E 24.04,37.46 24,37.5 | 24,43 22.7,44.3 12.62,44.3 R6.2 | Q12.E 26.78,5.46 24,8.24 24,13.4 | 24,13.4 24,21.5 | C1.+ 63.53,11.8 33.1,11.8 31.44,13.46 Q5.E 24.06,13.46 24,13.4 | Q9.E 24.04,21.46 24,21.5
  Bottom 0.813: 81.87,37.95 83.56,36.27 83.08,35.78 D1.C | 81.87,37.95 81.63,38.2 81.63,41.09 82.11,41.57 82.59,41.57 R17.2 | 81.87,37.95 81.63,37.71 79.22,37.71 R36.1 78.73,38.2 77.77,37.23 75.84,37.23 72.46,33.85 72.46,33.37 R37.1 71.98,32.89 69.08,29.99 69.08,17.44 67.63,15.99 C1.+
  Bottom 1.27: R30.2 14,6 16,8 16,11 | 16,11 13,14 R28.2 | 16,11 16,16.92 | 16,16.92 R9.2 | 16,16.92 16,24.92 | 16,24.92 R8.2 | 16,24.92 16,32.92 | 16,32.92 R7.2 | 16,32.92 16,40.92 R6.2
N$35
  Bottom 1.27: R26.2 21.62,10.54 Q12.C
N$36
  Bottom 1.27: R23.2 21.62,18.54 Q5.C
N$37
  Bottom 1.27: R24.2 21.62,26.54 Q9.C
N$38
  Bottom 1.27: R22.2 21.62,34.54 Q8.C
N$39
  Bottom 1.27: R21.2 21.62,42.54 Q7.C
N$40
  Bottom 1.27: R20.2 21.62,50.54 Q6.C
N$42
  Bottom 1.27: IC2.16 83.65,6.07 CATHODE.1
N$43
  Bottom 1.27: IC2.15 83.65,8.61 CATHODE.2
N$44
  Bottom 1.27: CATHODE.6 79.63,18.77 81.2,17.2 81.2,13.9 83.41,11.69 IC2.14
N$45
  Top 1.27: CATHODE.5 79.87,16.23 81.87,14.23 IC2.13
N$46
  Bottom 1.27: CATHODE.7 79.31,21.31 81.31,19.31 IC2.11
N$47
  Bottom 1.27: CATHODE.8 79.85,23.85 81.85,21.85 IC2.10
N$48
  Top 1.27: IC2.9 85.09,23.49 85.58,23.49 86.7,22.37 86.7,4.92 85.35,3.57 82.33,3.57 81.4,4.5 81.4,11.02 78.73,13.69 CATHODE.4
N$49
  Top 1.27: IC2.8 91.32,24.39 89.46,22.53 89.46,22.21 89,21.75 89,5 86,2 76.3,2 74.3,4 74.3,9.7 75.75,11.15 CATHODE.3
N$50
  Bottom 1.27: IC2.1 89.39,6.61 87.5,8.5 87.5,25.2 86.3,26.4 CATHODE.9
N$51
  Bottom 1.27: IC2.2 90.85,9.15 89.4,10.6 89.4,27.4 88,28.8 78.13,28.8 CATHODE.10
N$52
  Top 0.813: R36.2 69.08,37.71 75.84,37.71 78.25,35.3 78.25,34.82 78.73,34.33 78.25,33.85 NEON.1
N$53
  Bottom 0.813: R37.2 72.46,23.23 72.46,23.72 75.36,26.61 75.36,29.51 77.77,31.92 NEON.2
N$54
  Top 0.813: IC3.2 115.27,46.37 112.8,43.9 112.8,40.26 IC3.6
  Bottom 0.813: IC3.6 112.73,39.86 109.62,36.75 106.24,36.75 R16.1 C3.1
N$55
  Bottom 1.27: R10.2 Q6.B 23.08,48 R6.1
N$56
  Bottom 0.813: D1.A 93.21,35.78 93.21,32.4 94.18,31.44 94.66,31.44 R15.2 95.14,30.96 101.9,24.2 101.9,23.23 101.17,22.51 | 101.17,22.51 101.9,21.79 101.9,17.93 Q10.D | 101.17,22.51 100.93,22.75 100.45,22.75 L1.1
N$57
  Bottom 0.813: C4.1 82.11,30.47 83.56,30.47 84.53,31.44 R15.1
N$58
  Top 0.813: R16.2 106,30.92 113.15,38.07 113.31,38.07 114.14,38.9 114.14,39.06 IC3.7
  Bottom 0.813: R14.1 108.66,24.2 108.66,25.16 107.21,26.61 106.24,26.61 R16.2
N$59  (via drill 0.4)
  Top 0.813: v96.1,33.7 96.1,43.66 Q11.3
  Bottom 0.813: IC3.5 110.1,40.12 110.1,43.9 108.13,45.87 Q11.3 | 109.14,18.41 R5.1 108.92,20.88 v96.1,33.7
N$60
  Top 0.813: R19.1 85.97,45.92 83.08,48.81 80.66,48.81 79.7,49.78 79.7,50.26 R18.2
N$61
  Top 0.813: R19.3 86.45,50.74 86.94,50.74 87.42,51.23 90.32,48.33 90.32,44.95 93.21,42.06 R17.1
N$62
  Top 0.813: Q15.B 104.79,5.86 105.76,5.86 107.21,7.31 107.21,9.72 D2.A
  Bottom 0.813: IC3.3 112.73,46.87 114,45.6 118.3,45.6 119.75,44.15 119.75,29.03 114.7,23.97 114.7,18.9 112.4,16.6 112.4,14.3 110.1,12 R25.2 107.8,12 107.08,11.28 D2.A
N$63
  Top 0.813: Q15.E 99,5.86 98.04,5.86 97.07,6.83 97.07,9.72 D2.C
  Bottom 0.813: D2.C 97.07,10.2 97.07,16.48 98.04,17.44 99,17.44 Q10.G
N$64
  Bottom 0.813: R19.2 88.87,48.33 89.35,48.81 91.28,48.81 92.25,47.85 92.25,47.36 Q11.2
RESET
  Bottom 0.813: 137.85,6.1 139.54,7.79 140.26,7.07 | 137.85,6.1 137.13,5.38 136.16,5.38 R35.2 | 140.26,7.07 141.47,5.86 140.99,5.38 RESET.3 | 137.85,6.1 136.16,7.79 132.3,7.79 130.85,6.34 130.37,6.34 IC1.1 | 140.26,7.07 140.99,7.79 146.3,7.79 147.26,6.83 147.26,5.86 RESET.4
SCL
  Top 0.813: IC1.28 120.02,3.68 111.42,3.68 110,5.1 110.19,5.29 RTC.1
SDA
  Bottom 0.813: IC1.27 122.65,8.76 122.17,8.76 121.2,7.79 119.27,7.79 118.31,8.76 114.45,8.76 113,7.31 113,6.34 RTC.2
VCC
  Top 0.813: IC2.5 92.94,15.64 93.92,15.64 96.13,13.44 113.27,13.44 115.27,11.43 RTC.3 | IC1.7 131.94,21.56 133.3,20.2 133.3,17.3 135.52,15.08 R35.1 | L7805CV.OUT 149.46,28.54 148,30 C7.+
  pour Bottom: 2,42 2,52 4,54 170,54 172,52 172,8 172,4 170,2 4,2 2,4

### Text on the board
tNames: Danger! Danger! High Voltage! | Made by frod0r with help of nice people :)